# EAGLE design PMOD_USB (EAGLE 6.6.0)
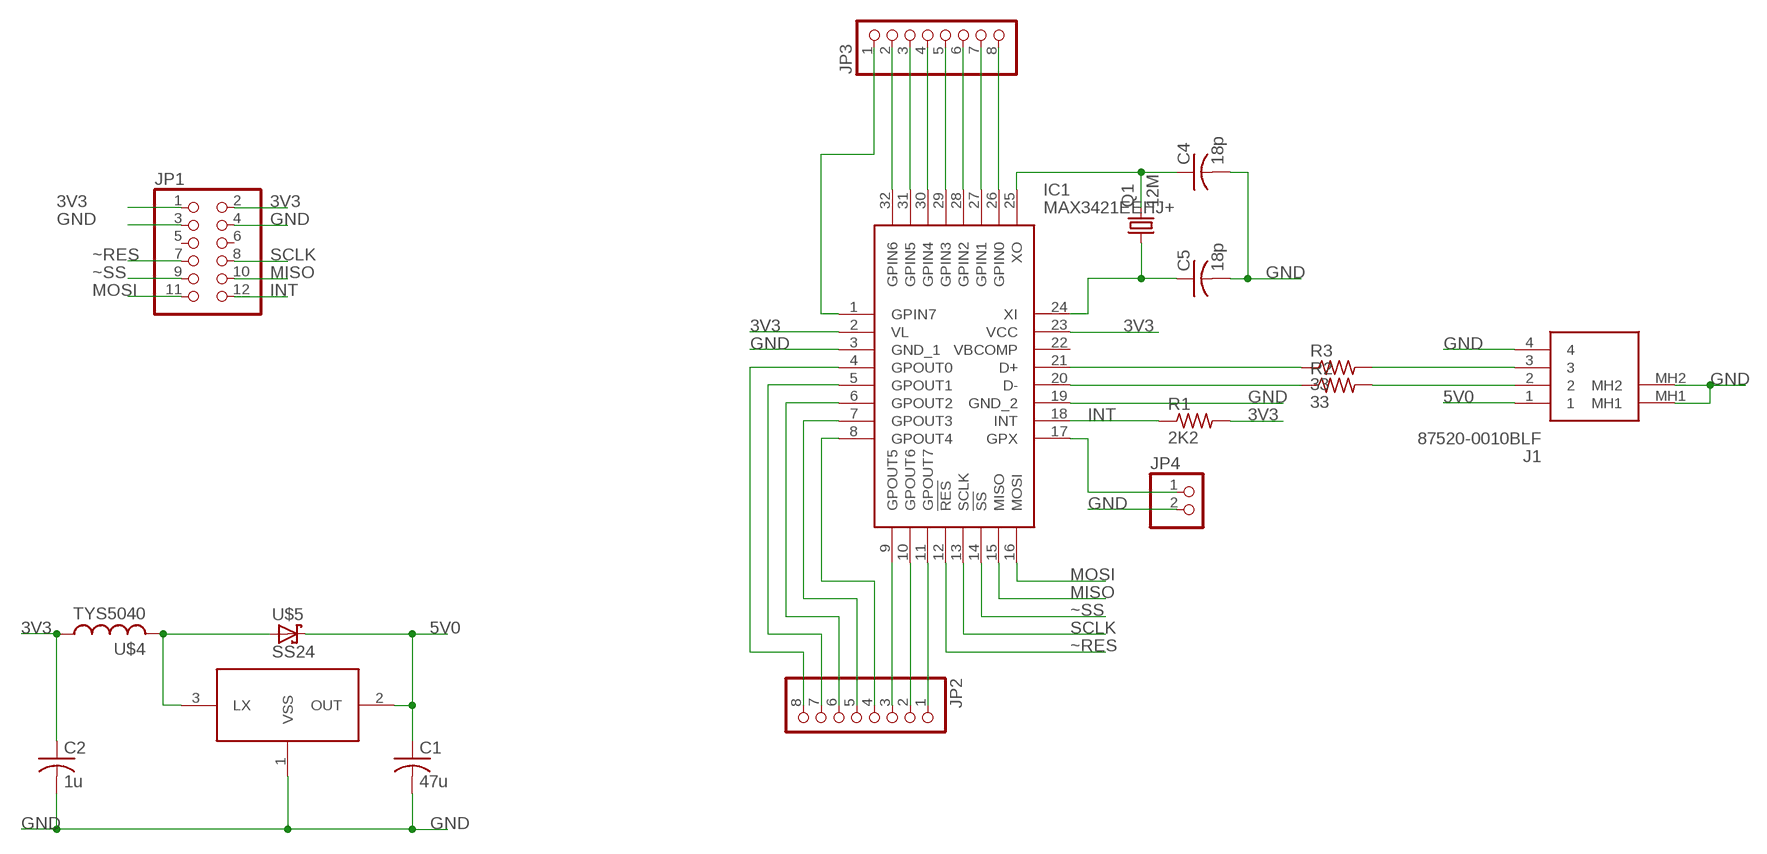
[diagram p0: schematic, sheet 1]

## Parts
C1  47u  C-USC1206K  [C1206K]
C2  1u  C-USC0805K  [C0805K]
C4  18p  C-USC0805  [C0805]
C5  18p  C-USC0805  [C0805]
IC1  MAX3421EEHJ+  [QFP50P700X700X120-32N]
J1  87520-0010BLF  [875200010BLF]
JP1  PINHD-2X6/90  [2X06/90]
JP2  PINHD-1X8  [1X08]
JP3  PINHD-1X8  [1X08]
JP4  PINHD-1X2  [1X02]
Q1  12M  CRYSTALHC49S  [HC49/S]
R1  2K2  R-US_R0805  [R0805]
R2  33  R-US_R0805  [R0805]
R3  33  R-US_R0805  [R0805]
U$4  TYS5040  [TYS5040]
U$5  SS24  [SMA-DO214AC]
U$6  ME2108A  [SOT89]

## Nets
3V3: C2.1 IC1.2(VL) IC1.23(VCC) JP1.1 JP1.2 R1.2 U$4.P$1
5V0: C1.1 J1.1 U$5.K(C) U$6.2(OUT)
GND: C1.2 C2.2 C4.2 C5.2 IC1.3(GND_1) IC1.19(GND_2) J1.4 J1.MH1 J1.MH2 JP1.3 JP1.4 JP4.2 U$6.1(VSS)
INT: IC1.18(INT) JP1.12 R1.1
MISO: IC1.15(MISO) JP1.10
MOSI: IC1.16(MOSI) JP1.11
N$1: IC1.26(GPIN0) JP3.8
N$2: IC1.27(GPIN1) JP3.7
N$3: IC1.28(GPIN2) JP3.6
N$4: IC1.29(GPIN3) JP3.5
N$5: IC1.30(GPIN4) JP3.4
N$6: IC1.31(GPIN5) JP3.3
N$7: U$4.P$2 U$5.A U$6.3(LX)
N$8: IC1.32(GPIN6) JP3.2
N$9: IC1.1(GPIN7) JP3.1
N$10: IC1.11(GPOUT7) JP2.1
N$11: IC1.10(GPOUT6) JP2.2
N$12: IC1.9(GPOUT5) JP2.3
N$13: IC1.8(GPOUT4) JP2.4
N$14: IC1.7(GPOUT3) JP2.5
N$15: IC1.6(GPOUT2) JP2.6
N$16: IC1.5(GPOUT1) JP2.7
N$17: IC1.4(GPOUT0) JP2.8
N$18: IC1.17(GPX) JP4.1
N$19: C4.1 IC1.25(XO) Q1.2
N$20: C5.1 IC1.24(XI) Q1.1
N$26: IC1.20(D-) R2.1
N$27: J1.2 R2.2
N$28: J1.3 R3.2
N$29: IC1.21(D+) R3.1
SCLK: IC1.13(SCLK) JP1.8
~RES: IC1.12(!RES) JP1.7
~SS: IC1.14(!SS) JP1.9
Unconnected: IC1.22(VBCOMP) JP1.5 JP1.6

## Library data of the parts
C1 C2 C4 C5 = rcl:C-US: CAPACITOR, American symbol
IC1 = Signetics:MAX3421EEHJ+: MAX3421EEHJ+, USB Controller 12 Mbit/s USB 2.0, 3.3 V, 32-Pin, TQFP Source: Datasheet; DESCRIPTION: MAX3421EEHJ+, USB Controller 12 Mbit/s USB 2.0, 3.3 V, 32-Pin, TQFP; HEIGHT: 1.2mm; MANUFACTURER_NAME: Maxim Integrated; MANUFACTURER_PART_NUMBER: MAX3421EEHJ+; MOUSER_PART_NUMBER: 700-MAX3421EEHJ; MOUSER_PRICE-STOCK: https://www.mouser.co.uk/ProductDetail/Maxim-Integrated/MAX3421EEHJ%2b?qs=1THa7WoU59FLwATVjyu%252Brg%3D%3D
J1 = Signetics:87520-0010BLF: USB 2.0 Type A receptacle white Source: Datasheet <https://componentsearchengine.com/Datasheets/1/87520-0010BLF.pdf>; DESCRIPTION: USB 2.0 Type A receptacle white; HEIGHT: 7.8mm; MANUFACTURER_NAME: Amphenol; MANUFACTURER_PART_NUMBER: 87520-0010BLF; MOUSER_PART_NUMBER: 649-87520-0010BLF; MOUSER_PRICE-STOCK: https://www.mouser.co.uk/ProductDetail/Amphenol-FCI/87520-0010BLF?qs=x6EjVpvqMVP%2F2to87x7cdQ%3D%3D
JP1 = pinhead:PINHD-2X6: PIN HEADER
JP2 JP3 = pinhead:PINHD-1X8: PIN HEADER
JP4 = pinhead:PINHD-1X2: PIN HEADER
Q1 = crystal:CRYSTAL: CRYSTAL; OC_FARNELL: 1667008; OC_NEWARK: unknown
R1-R3 = rcl:R-US_: RESISTOR, American symbol
U$4 = Signetics:TYS5040
U$5 = Signetics:SS24
U$6 = Signetics:ME2108A

## Board
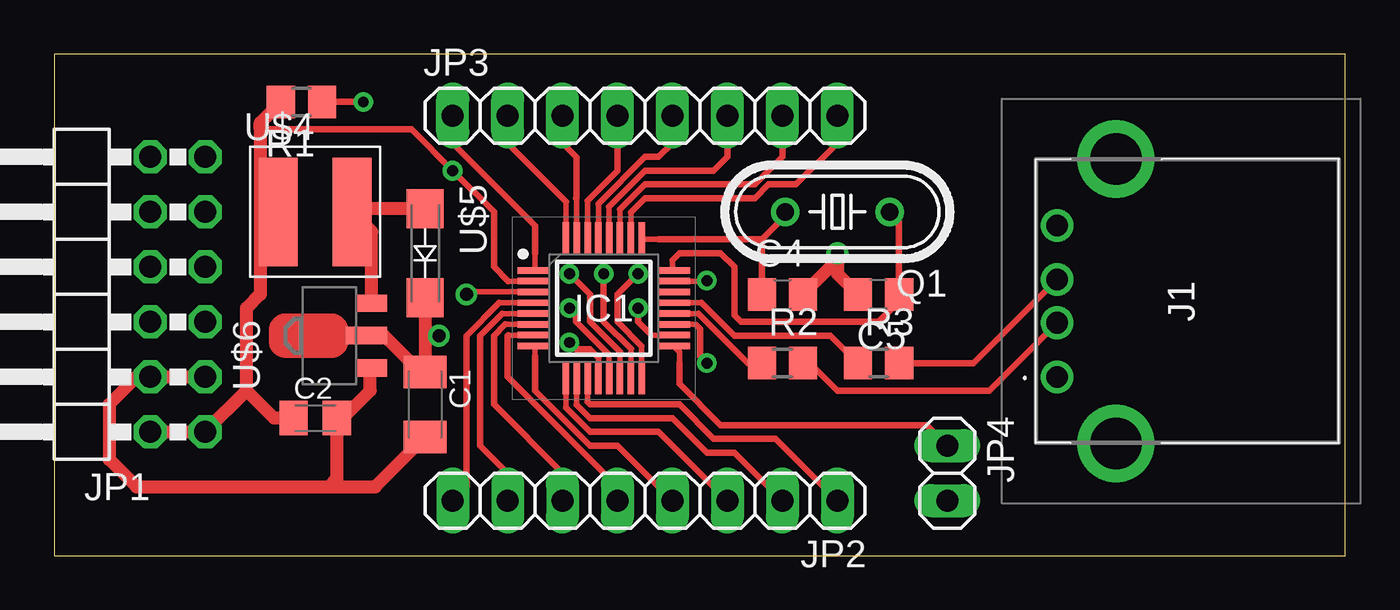
[diagram p1: board, top side]
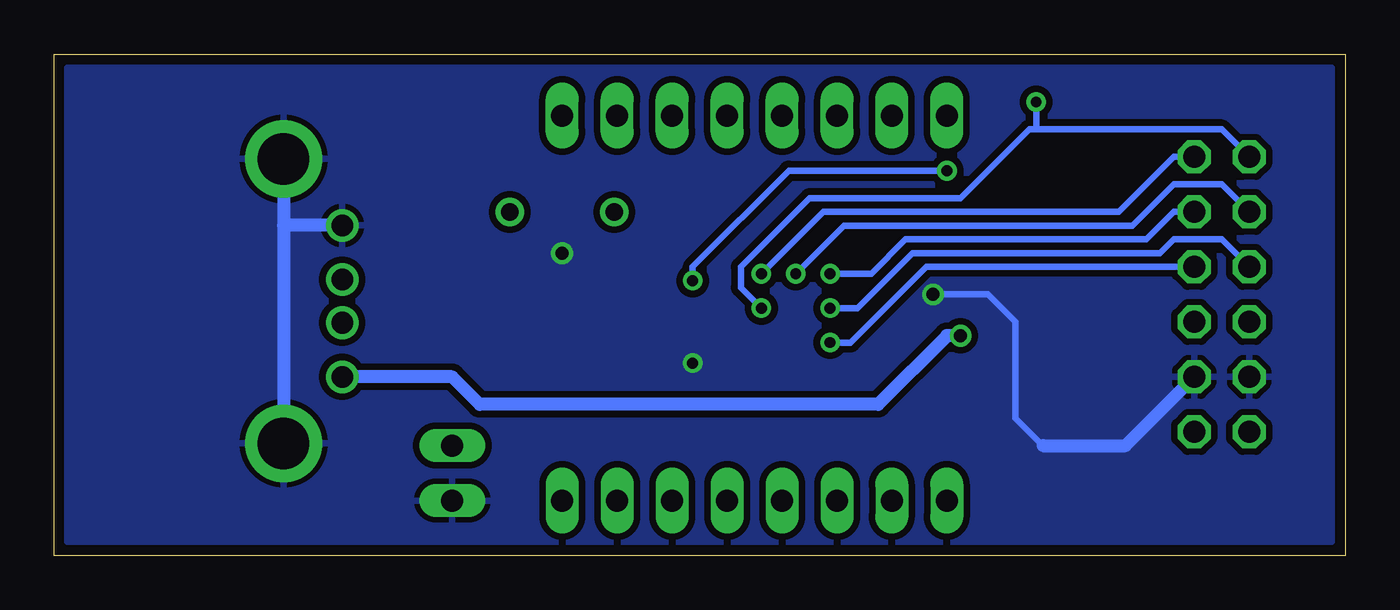
[diagram p2: board, bottom side, seen from below]

Size 59.67 x 23.17 mm. Coordinates in mm from the lower left corner, seen from the top.
Outline: 0,0 59.67,0 59.67,23.17 0,23.17 0,0
Copper layers (1*16): Top 0.035mm / dielectric 1.5mm / Bottom 0.035mm
Design rules "JLC": minimum track width 5mil, minimum drill 0.2mm, track to track 5mil, track to pad 0.2mm, pad to pad 5mil, via to via 0.54mm, smd to smd 0.003225mm, copper to edge 0.2mm, drill to drill 0.54mm, minimum pad ring 10mil, minimum via ring 8mil, stop-mask expansion 4mil, vias tented up to drill 0mil, thermal gap 10mil

### Footprints (pad centres in the part's own frame; a part is rotated, then mirrored left to right if it is on the bottom)
C1206K = smd 1.5 x 2: 1 -1.5,0; 2 1.5,0
C0805K = smd 1.3 x 1.6: 1 -1,0; 2 1,0
C0805 = smd 1.3 x 1.5: 1 -0.95,0; 2 0.95,0
QFP50P700X700X120-32N = smd 1.475 x 0.3: 1 -3.238,1.75; 2 -3.238,1.25; 3 -3.238,0.75; 4 -3.238,0.25; 5 -3.238,-0.25; 6 -3.238,-0.75; 7 -3.238,-1.25; 8 -3.238,-1.75; 17 3.238,-1.75; 18 3.238,-1.25; 19 3.238,-0.75; 20 3.238,-0.25; 21 3.238,0.25; 22 3.238,0.75; 23 3.238,1.25; 24 3.238,1.75 | smd 0.3 x 1.475: 9 -1.75,-3.238; 10 -1.25,-3.238; 11 -0.75,-3.238; 12 -0.25,-3.238; 13 0.25,-3.238; 14 0.75,-3.238; 15 1.25,-3.238; 16 1.75,-3.238; 25 1.75,3.238; 26 1.25,3.238; 27 0.75,3.238; 28 0.25,3.238; 29 -0.25,3.238; 30 -0.75,3.238; 31 -1.25,3.238; 32 -1.75,3.238
875200010BLF = drill 1 pad 1.5: 1 0,0; 2 2.5,0; 3 4.5,0; 4 7,0 | drill 2.38 pad 3.57: MH1 -3.07,-2.71; MH2 10.07,-2.71
2X06/90 = drill 1.016 octagon: 1 -6.35,-6.35; 2 -6.35,-3.81; 3 -3.81,-6.35; 4 -3.81,-3.81; 5 -1.27,-6.35; 6 -1.27,-3.81; 7 1.27,-6.35; 8 1.27,-3.81; 9 3.81,-6.35; 10 3.81,-3.81; 11 6.35,-6.35; 12 6.35,-3.81
1X08 = drill 1.016 long: 1 -8.89,0; 2 -6.35,0; 3 -3.81,0; 4 -1.27,0; 5 1.27,0; 6 3.81,0; 7 6.35,0; 8 8.89,0
1X02 = drill 1.016 long: 1 -1.27,0; 2 1.27,0
HC49/S = drill 0.813: 1 -2.413,0; 2 2.413,0
R0805 = smd 1.3 x 1.5: 1 -0.95,0; 2 0.95,0
TYS5040 = smd 1.8 x 5: P$1 -1.7,0; P$2 1.7,0
SMA-DO214AC = smd 1.8 x 1.7: A -2.05,0; K 2.05,0
SOT89 = smd 0.8 x 1.4: 1 -1.499,-1.981; 3 1.499,-1.981 | smd 0.8 x 1.9: 2 0,-1.727

### Placement (x,y rotation side)
C1  17.14,6.98 270 top
C2  12.06,6.35 0 top
C4  33.66,12.06 0 top
C5  38.1,12.06 180 top
IC1  25.4,11.43 0 top
J1  46.35,8.26 90 top
JP1  0.64,12.06 90 top
JP2  27.3,2.54 180 top
JP3  27.3,20.32 0 top
JP4  41.27,3.81 270 top
Q1  36.2,15.88 180 top
R1  11.43,20.96 180 top
R2  33.66,8.89 0 top
R3  38.1,8.89 0 top
U$4  12.06,15.88 0 top
U$5  17.14,13.97 270 top
U$6  12.7,10.16 90 top

### Tracks (layer width: path | path; a pad name or v marks a point on that pad's centre or on a via)
3V3  (via drill 0.5)
  Top 0.254: IC1.2 20.98,12.68 | IC1.23 30.14,12.68
  Top 0.305: 20.98,12.68 20.32,13.33 20.32,15.88 v18.41,17.78 16.51,19.69 9.53,19.69 | 30.14,12.68 v30.16,12.7
  Top 0.61: JP1.2 JP1.1 8.89,7.62 | R1.2 9.53,20 9.53,19.69 9.53,15.88 | 9.53,15.88 9.53,12.06 8.89,11.43 8.89,7.62 | C2.1 10.16,6.35 8.89,7.62 | U$4.P$1 9.53,15.88
  Bottom 0.305: v30.16,12.7 30.16,13.33 25.72,17.78 v18.41,17.78
5V0  (via drill 0.6)
  Top 0.61: U$6.2 15.24,10.16 16.51,8.89 16.74,8.89 C1.1 17.14,10.16 | U$5.K 17.14,10.16 | v17.78,10.16 17.14,10.16
  Bottom 0.61: v17.78,10.16 18.41,10.16 21.59,6.98 40.01,6.98 41.27,8.26 J1.1
GND  (via drill 0.5, 0.6)
  Top 0.254: IC1.3 19.16,12.18 | IC1.19 29.64,10.68 29.84,10.48
  Top 0.305: 19.16,12.18 v19.05,12.06 | 29.84,10.48 29.84,9.21 v30.16,8.89
  Top 0.61: JP1.3 JP1.4 3.81,8.26 2.54,6.98 2.54,4.45 3.81,3.17 12.7,3.17 | 12.7,3.17 14.84,3.17 C1.2 | 12.7,3.17 13.06,3.54 C2.2 13.34,6.35 14.61,7.62 14.61,8.59 U$6.1 | C4.2 36.2,13.65 v36.2,13.97 36.2,13.02 C5.2
  Bottom 0.305: v19.05,12.06 16.51,12.06 15.24,10.79 15.24,6.35 13.97,5.08
  Bottom 0.61: J1.MH2 49.06,15.24 | 49.06,15.24 J1.MH1 | 13.97,5.08 10.16,5.08 JP1.3 | J1.4 49.05,15.25 49.06,15.24
  pour Bottom (isolate 0.305): 0.64,22.54 59.05,22.54 59.05,0.64 0.64,0.64
INT  (via drill 0.5)
  Top 0.254: IC1.18 27.6,10.18
  Top 0.305: v26.99,11.43 26.99,10.79 27.6,10.18 | R1.1 v14.29,20.96
  Bottom 0.305: JP1.12 5.71,19.69 14.29,19.69 | 14.29,19.69 14.61,19.69 17.78,16.51 24.77,16.51 27.94,13.33 27.94,12.38 v26.99,11.43 | v14.29,20.96 14.29,19.69
MISO  (via drill 0.5)
  Top 0.254: IC1.15 26.65,9.54
  Top 0.305: 26.65,9.54 25.4,10.79 v25.4,13.02
  Bottom 0.305: JP1.10 5.71,17.15 7.94,17.15 9.84,15.24 23.18,15.24 v25.4,13.02
MOSI  (via drill 0.5)
  Top 0.254: IC1.16 27.15,9.68
  Top 0.305: 27.15,9.68 26.04,10.79 26.04,12.06 v26.99,13.02
  Bottom 0.305: JP1.11 7.94,18.42 10.48,15.88 24.13,15.88 v26.99,13.02
N$1
  Top 0.254: 26.65,15.86 IC1.26
  Top 0.305: 26.65,15.86 27.3,16.51 32.38,16.51 33.02,17.15 34.29,17.15 36.2,19.05 JP3.8
N$2
  Top 0.254: 26.15,15.99 IC1.27
  Top 0.305: 26.15,15.99 27.3,17.15 32.38,17.15 33.66,18.42 JP3.7
N$3
  Top 0.254: 25.65,16.12 IC1.28
  Top 0.305: 25.65,16.12 27.3,17.78 30.48,17.78 31.11,18.42 JP3.6
N$4
  Top 0.254: 25.15,16.26 IC1.29
  Top 0.305: 25.15,16.26 27.3,18.42 27.94,18.42 28.57,19.05 JP3.5
N$5
  Top 0.254: 24.65,16.39 IC1.30
  Top 0.305: 24.65,16.39 26.04,17.78 JP3.4
N$6
  Top 0.254: IC1.31 24.15,16.49 24.13,16.51
  Top 0.305: JP3.3 23.5,19.05 24.15,18.4 24.15,16.53 24.13,16.51
N$7
  Top 0.61: U$6.3 14.68,14.96 U$4.P$2 13.91,16.02 U$5.A
N$8
  Top 0.254: IC1.32 23.65,16.36
  Top 0.305: 23.65,16.36 20.95,19.05 JP3.2
N$9
  Top 0.254: IC1.1 22.23,13.24 22.23,13.97
  Top 0.305: JP3.1 18.41,19.05 22.23,15.24 22.23,13.97
N$10
  Top 0.254: IC1.11 24.65,7.1
  Top 0.305: 24.65,7.1 24.77,6.98 28.89,6.98 30.48,5.4 33.34,5.4 JP2.1
N$11
  Top 0.254: IC1.10 24.15,6.96
  Top 0.305: 24.15,6.96 24.77,6.35 28.57,6.35 30.16,4.76 31.43,4.76 JP2.2
N$12
  Top 0.254: IC1.9 23.65,6.83
  Top 0.305: 23.65,6.83 24.77,5.71 27.94,5.71 JP2.3
N$13
  Top 0.254: IC1.8 22.23,9.62 22.23,9.21
  Top 0.305: 22.23,9.21 22.23,7.62 24.77,5.08 26.04,5.08 JP2.4
N$14
  Top 0.254: IC1.7 20.98,10.18
  Top 0.305: 20.98,10.18 20.95,10.16 20.95,8.26 26.04,3.17 JP2.5
N$15
  Top 0.254: IC1.6 20.84,10.68
  Top 0.305: 20.84,10.68 20.32,10.16 20.32,6.98 23.5,3.81 JP2.6
N$16
  Top 0.254: IC1.5 20.7,11.18
  Top 0.305: 20.7,11.18 19.68,10.16 19.68,5.08 20.95,3.81 JP2.7
N$17
  Top 0.254: IC1.4 20.57,11.68
  Top 0.305: 20.57,11.68 19.05,10.16 19.05,3.17 JP2.8
N$18
  Top 0.254: 28.89,8.89 28.89,9.42 IC1.17
  Top 0.305: 28.89,8.89 28.89,7.94 30.8,6.03 40.32,6.03 JP4.1
N$19
  Top 0.254: IC1.25 27.21,14.61 27.94,14.61
  Top 0.305: 27.94,14.61 32.7,14.61 | 32.7,14.61 33.78,15.69 Q1.2 | 32.7,14.61 32.7,14.6 C4.1
N$20
  Top 0.254: IC1.24 28.57,13.24 28.57,13.65
  Top 0.305: Q1.1 39.05,15.43 C5.1 38.73,11.75 38.73,11.43 38.1,10.79 31.75,10.79 31.43,11.11 31.43,13.33 30.8,13.97 28.89,13.97 28.57,13.65
N$26
  Top 0.254: IC1.20 29.78,11.18
  Top 0.305: R2.1 32.07,8.89 29.78,11.18
N$27
  Top 0.305: R2.2 34.92,8.89 36.2,7.62 43.22,7.62 J1.2
N$28
  Top 0.305: R3.2 42.49,8.89 J1.3
N$29
  Top 0.254: IC1.21 29.91,11.68
  Top 0.305: R3.1 35.88,10.16 31.43,10.16 29.91,11.68
SCLK  (via drill 0.5)
  Top 0.254: IC1.13 25.65,9.28
  Top 0.305: 25.65,9.28 24.13,10.79 24.13,11.11 v23.81,11.43
  Bottom 0.305: JP1.8 5.71,14.61 7.94,14.61 8.57,13.97 20,13.97 22.54,11.43 v23.81,11.43
~RES  (via drill 0.5)
  Top 0.254: IC1.12 25.15,9.14
  Top 0.305: 25.15,9.14 24.77,9.53 24.13,9.53 v23.81,9.84
  Bottom 0.305: JP1.7 19.37,13.33 22.86,9.84 v23.81,9.84
~SS  (via drill 0.5)
  Top 0.254: IC1.14 26.15,9.41
  Top 0.305: 26.15,9.41 24.77,10.79 24.77,12.06 v23.81,13.02
  Bottom 0.305: JP1.9 7.94,15.88 9.21,14.61 20.32,14.61 21.91,13.02 v23.81,13.02